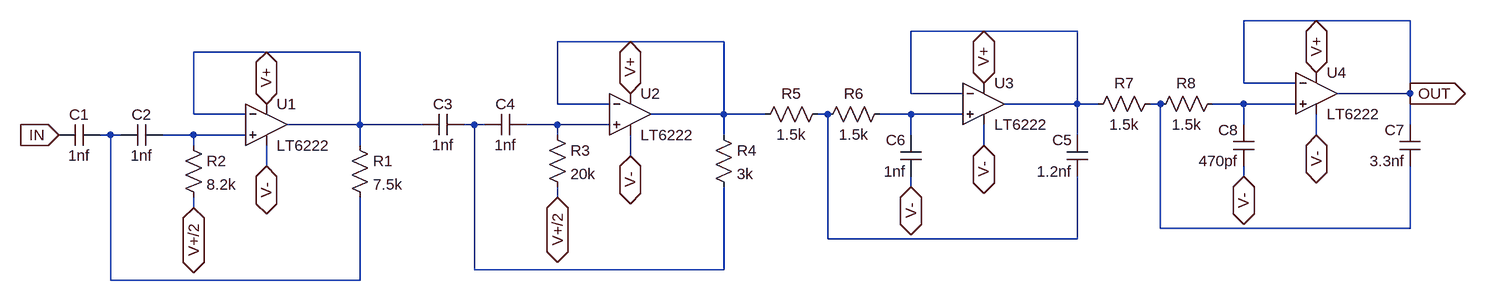
[diagram p0: schematic RX_Cascaded_HPF_LPF.asc]
RX_Cascaded_HPF_LPF.asc, the LTspice schematic file:
Version 4.1
SHEET 1 2060 708
WIRE 1952 0 1696 0
WIRE 1440 16 1184 16
WIRE 896 32 640 32
WIRE 336 48 80 48
WIRE 1696 96 1696 0
WIRE 1776 96 1696 96
WIRE 1184 112 1184 16
WIRE 1264 112 1184 112
WIRE 1952 112 1952 0
WIRE 1952 112 1840 112
WIRE 640 128 640 32
WIRE 720 128 640 128
WIRE 1440 128 1440 16
WIRE 1440 128 1328 128
WIRE 1472 128 1440 128
WIRE 1568 128 1552 128
WIRE 1696 128 1648 128
WIRE 1776 128 1696 128
WIRE 80 144 80 48
WIRE 160 144 80 144
WIRE 896 144 896 32
WIRE 896 144 784 144
WIRE 960 144 896 144
WIRE 1056 144 1040 144
WIRE 1184 144 1136 144
WIRE 1264 144 1184 144
WIRE 336 160 336 48
WIRE 336 160 224 160
WIRE 432 160 336 160
WIRE 512 160 496 160
WIRE 528 160 512 160
WIRE 640 160 592 160
WIRE 720 160 640 160
WIRE 1696 160 1696 128
WIRE 1952 160 1952 112
WIRE -48 176 -64 176
WIRE -32 176 -48 176
WIRE 80 176 32 176
WIRE 160 176 80 176
WIRE 640 176 640 160
WIRE 896 176 896 144
WIRE 1184 176 1184 144
WIRE 1440 176 1440 128
WIRE 1808 176 1808 144
WIRE 80 192 80 176
WIRE 336 192 336 160
WIRE 1296 192 1296 160
WIRE 752 208 752 176
WIRE 192 224 192 192
WIRE 1696 240 1696 224
WIRE 1184 256 1184 240
WIRE 640 272 640 256
WIRE 80 288 80 272
WIRE 1568 320 1568 128
WIRE 1952 320 1952 224
WIRE 1952 320 1568 320
WIRE 1056 336 1056 144
WIRE 1440 336 1440 240
WIRE 1440 336 1056 336
WIRE 512 384 512 160
WIRE 896 384 896 256
WIRE 896 384 512 384
WIRE -48 400 -48 176
WIRE 336 400 336 272
WIRE 336 400 -48 400
FLAG 192 128 V+
IOPIN 192 128 BiDir
FLAG 752 112 V+
IOPIN 752 112 BiDir
FLAG 1296 96 V+
IOPIN 1296 96 BiDir
FLAG 1808 80 V+
IOPIN 1808 80 BiDir
FLAG 80 288 V+/2
IOPIN 80 288 BiDir
FLAG 640 272 V+/2
IOPIN 640 272 BiDir
FLAG 1184 256 V-
IOPIN 1184 256 BiDir
FLAG 1696 240 V-
IOPIN 1696 240 BiDir
FLAG -128 176 IN
IOPIN -128 176 In
FLAG 1952 112 OUT
IOPIN 1952 112 Out
FLAG 192 224 V-
IOPIN 192 224 BiDir
FLAG 752 208 V-
IOPIN 752 208 BiDir
FLAG 1296 192 V-
IOPIN 1296 192 BiDir
FLAG 1808 176 V-
IOPIN 1808 176 BiDir
SYMBOL OpAmps\\LT6222 192 160 R0
SYMATTR InstName U1
SYMBOL cap -64 160 R90
WINDOW 0 0 32 VBottom 2
WINDOW 3 32 32 VTop 2
SYMATTR InstName C1
SYMATTR Value 1nf
SYMBOL cap 32 160 R90
WINDOW 0 0 32 VBottom 2
WINDOW 3 32 32 VTop 2
SYMATTR InstName C2
SYMATTR Value 1nf
SYMBOL res 64 176 R0
SYMATTR InstName R2
SYMATTR Value 8.2k
SYMBOL res 320 176 R0
SYMATTR InstName R1
SYMATTR Value 7.5k
SYMBOL OpAmps\\LT6222 752 144 R0
SYMATTR InstName U2
SYMBOL cap 496 144 R90
WINDOW 0 0 32 VBottom 2
WINDOW 3 32 32 VTop 2
SYMATTR InstName C3
SYMATTR Value 1nf
SYMBOL cap 592 144 R90
WINDOW 0 0 32 VBottom 2
WINDOW 3 32 32 VTop 2
SYMATTR InstName C4
SYMATTR Value 1nf
SYMBOL res 624 160 R0
SYMATTR InstName R3
SYMATTR Value 20k
SYMBOL res 880 160 R0
SYMATTR InstName R4
SYMATTR Value 3k
SYMBOL OpAmps\\LT6222 1296 128 R0
SYMATTR InstName U3
SYMBOL cap 1456 240 R180
WINDOW 0 24 56 Left 2
WINDOW 3 24 8 Left 2
SYMATTR InstName C5
SYMATTR Value 1.2nf
SYMBOL res 1056 128 R90
WINDOW 0 0 56 VBottom 2
WINDOW 3 32 56 VTop 2
SYMATTR InstName R5
SYMATTR Value 1.5k
SYMBOL res 1152 128 R90
WINDOW 0 0 56 VBottom 2
WINDOW 3 32 56 VTop 2
SYMATTR InstName R6
SYMATTR Value 1.5k
SYMBOL cap 1200 240 R180
WINDOW 0 24 56 Left 2
WINDOW 3 24 8 Left 2
SYMATTR InstName C6
SYMATTR Value 1nf
SYMBOL OpAmps\\LT6222 1808 112 R0
SYMATTR InstName U4
SYMBOL cap 1968 224 R180
WINDOW 0 24 56 Left 2
WINDOW 3 24 8 Left 2
SYMATTR InstName C7
SYMATTR Value 3.3nf
SYMBOL res 1568 112 R90
WINDOW 0 0 56 VBottom 2
WINDOW 3 32 56 VTop 2
SYMATTR InstName R7
SYMATTR Value 1.5k
SYMBOL res 1664 112 R90
WINDOW 0 0 56 VBottom 2
WINDOW 3 32 56 VTop 2
SYMATTR InstName R8
SYMATTR Value 1.5k
SYMBOL cap 1712 224 R180
WINDOW 0 24 56 Left 2
WINDOW 3 24 8 Left 2
SYMATTR InstName C8
SYMATTR Value 470pf

The netlist it stands for:
* RX_Cascaded_HPF_LPF.asc
* U1: LT6222 (symbol OpAmps\LT6222 not available, pins judged from their places): In+=N011 In-=N003 V+=V+ V-=V- OUT=N003
C1 N010 IN 1nf
C2 N011 N010 1nf
R2 N011 V+/2 8.2k
R1 N003 N010 7.5k
* U2: LT6222 (symbol OpAmps\LT6222 not available, pins judged from their places): In+=N009 In-=N002 V+=V+ V-=V- OUT=N002
C3 N008 N003 1nf
C4 N009 N008 1nf
R3 N009 V+/2 20k
R4 N002 N008 3k
* U3: LT6222 (symbol OpAmps\LT6222 not available, pins judged from their places): In+=N007 In-=N001 V+=V+ V-=V- OUT=N001
C5 N006 N001 1.2nf
R5 N006 N002 1.5k
R6 N007 N006 1.5k
C6 V- N007 1nf
* U4: LT6222 (symbol OpAmps\LT6222 not available, pins judged from their places): In+=N005 In-=OUT V+=V+ V-=V- OUT=OUT
C7 N004 OUT 3.3nf
R7 N004 N001 1.5k
R8 N005 N004 1.5k
C8 V- N005 470pf
.backanno
.end